# Altium project array_4x4.PrjPcb
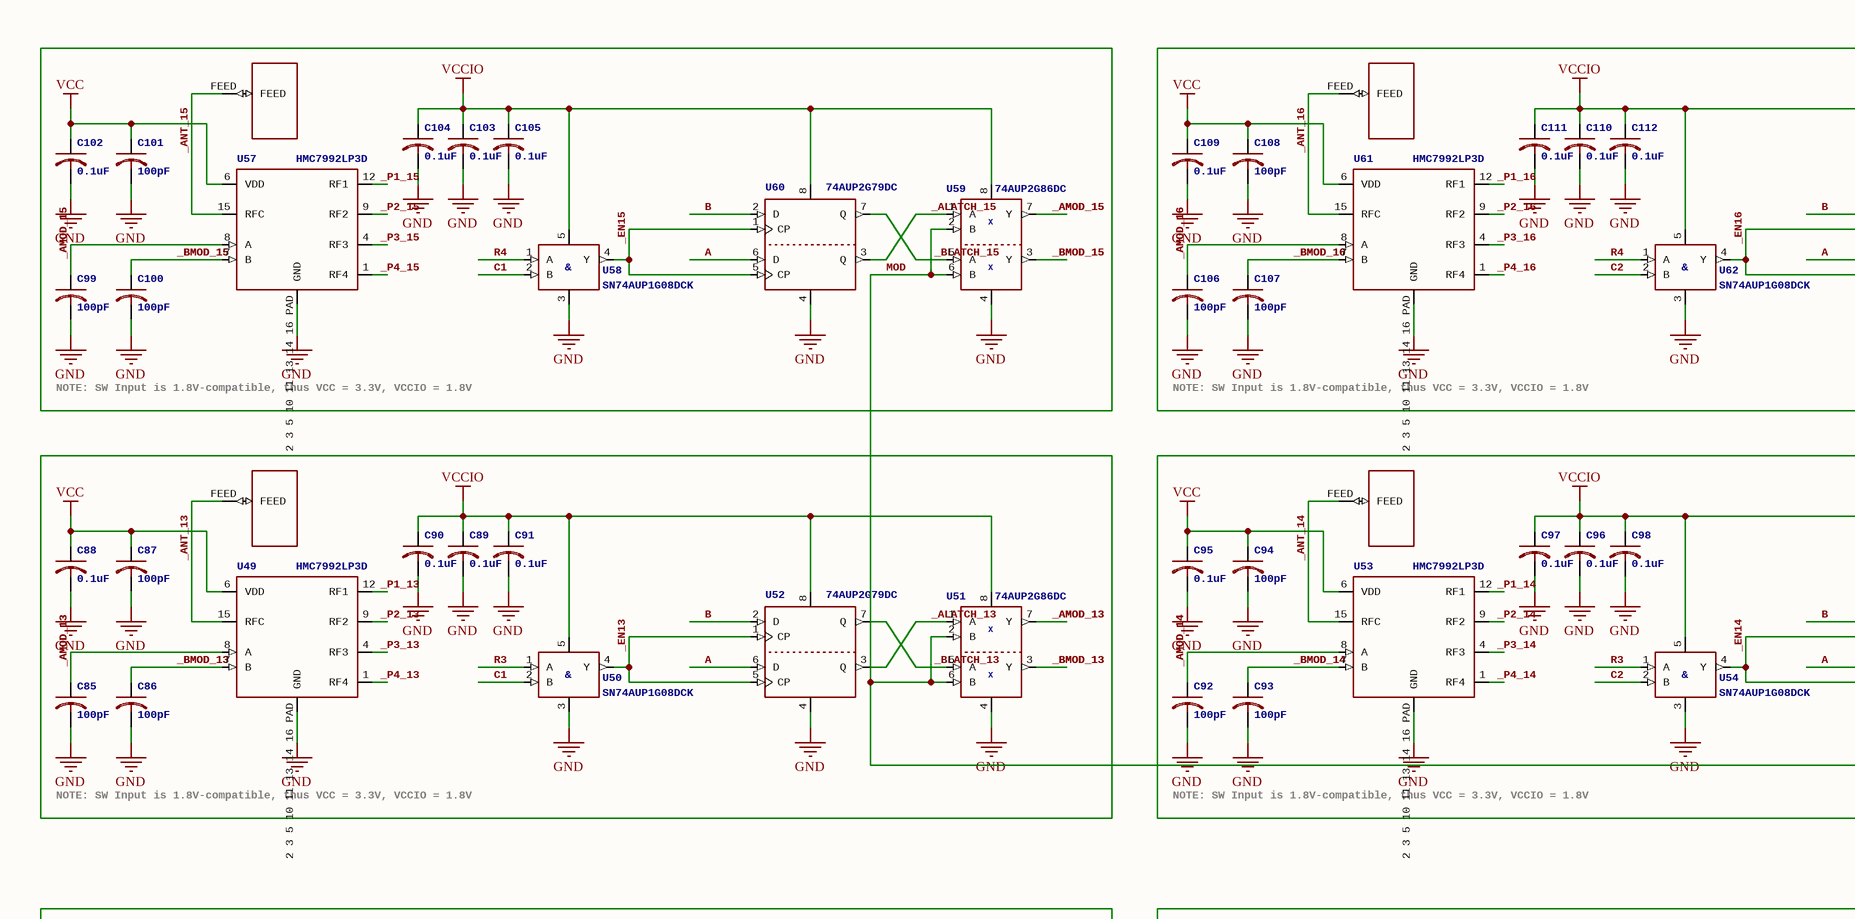
[diagram p0: array_4x4.SchDoc, top left]
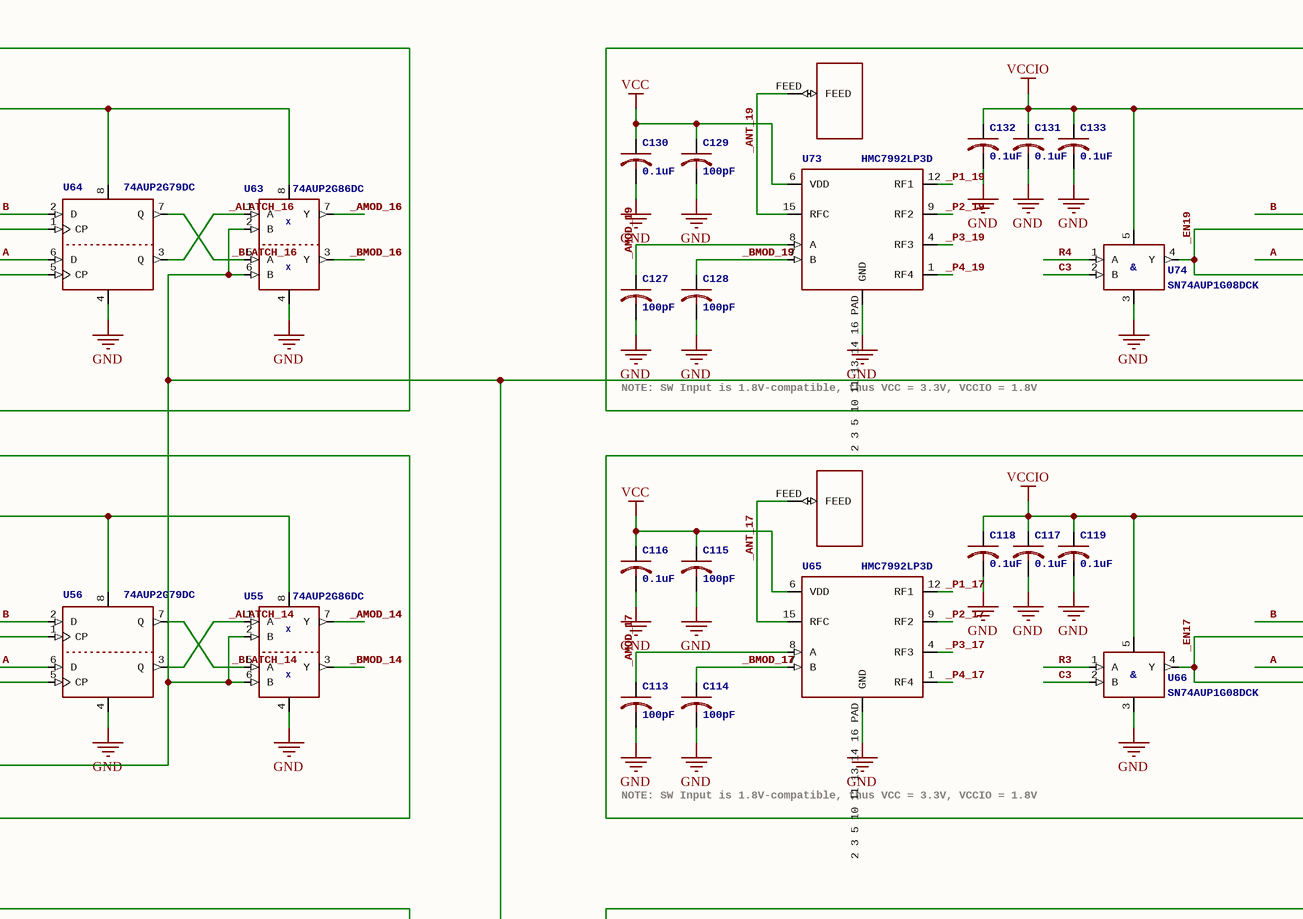
[diagram p1: array_4x4.SchDoc, top middle]
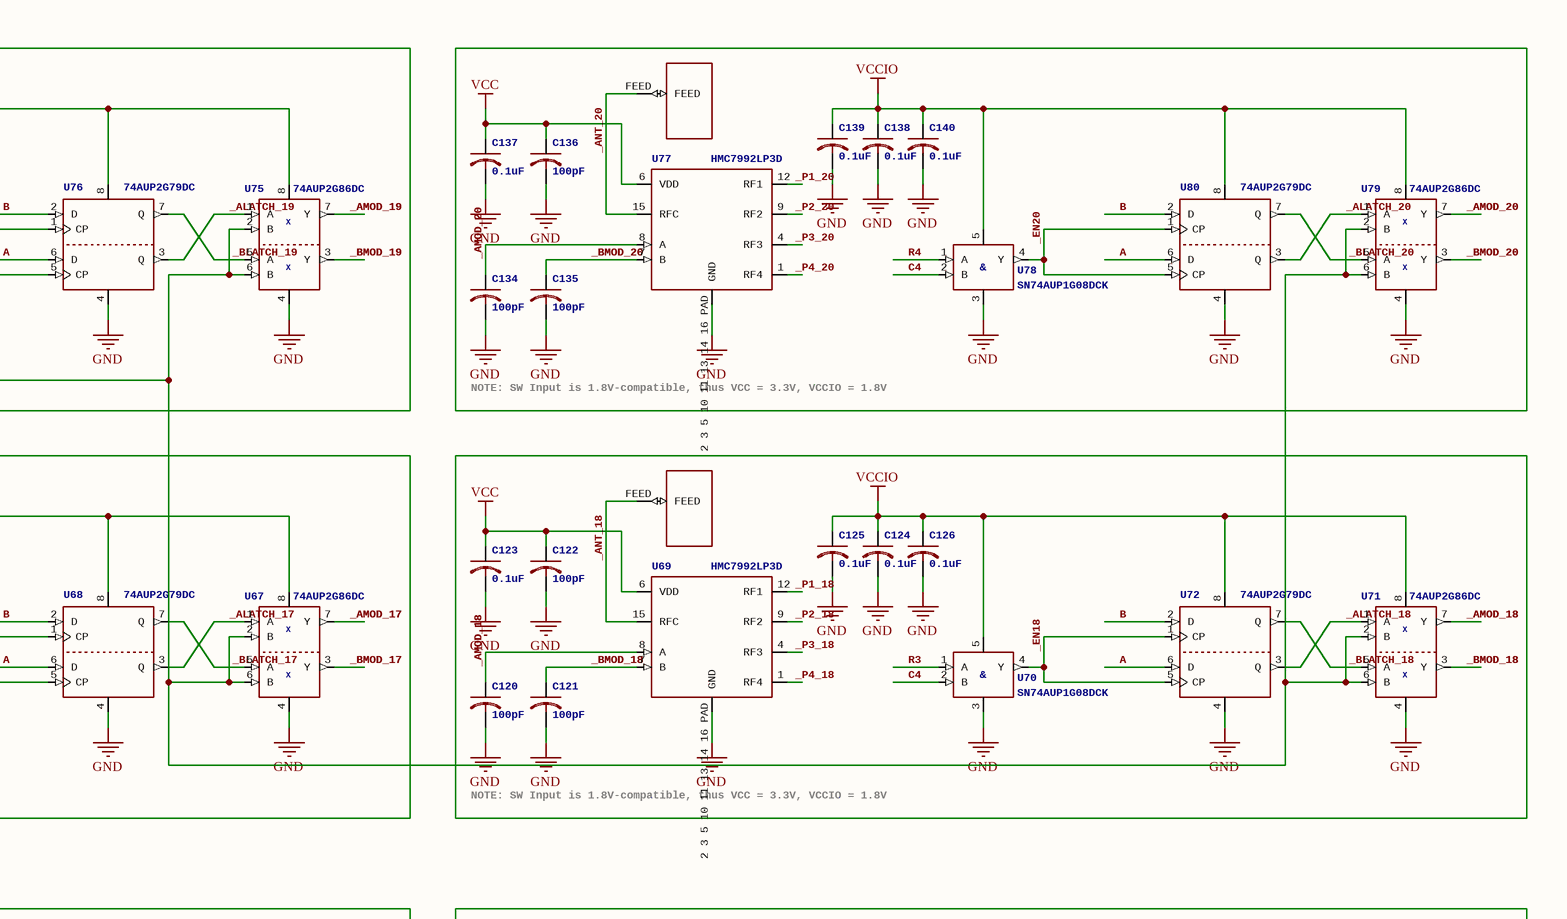
[diagram p2: array_4x4.SchDoc, top right]
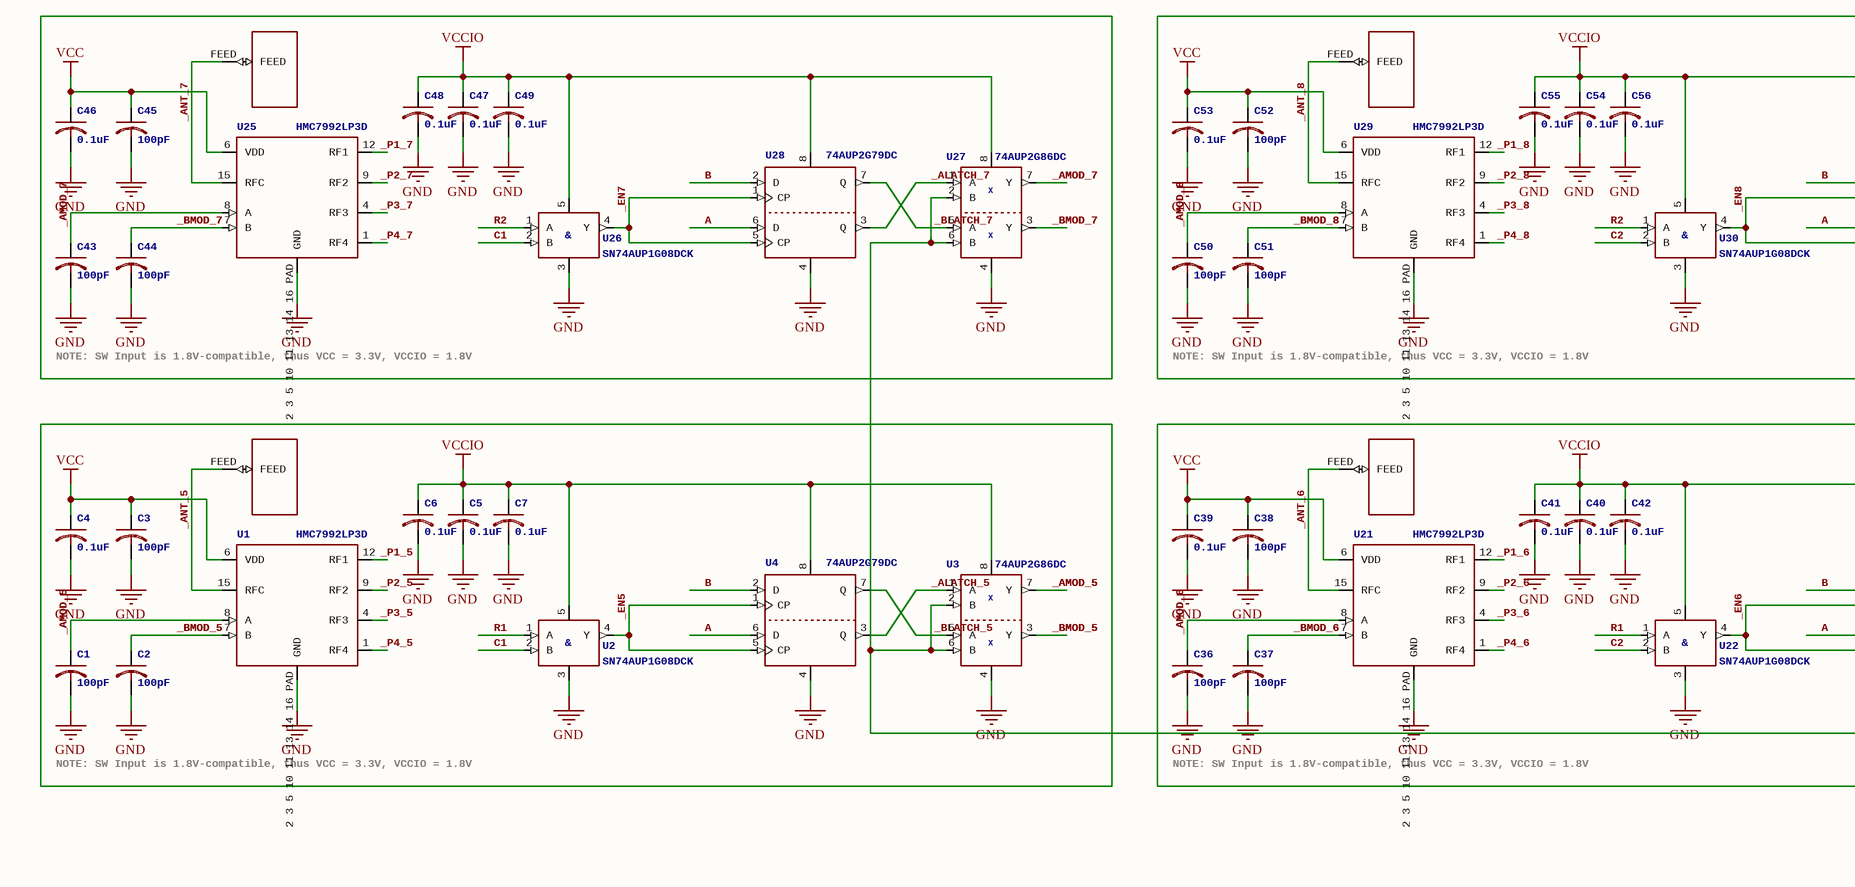
[diagram p3: array_4x4.SchDoc, bottom left]
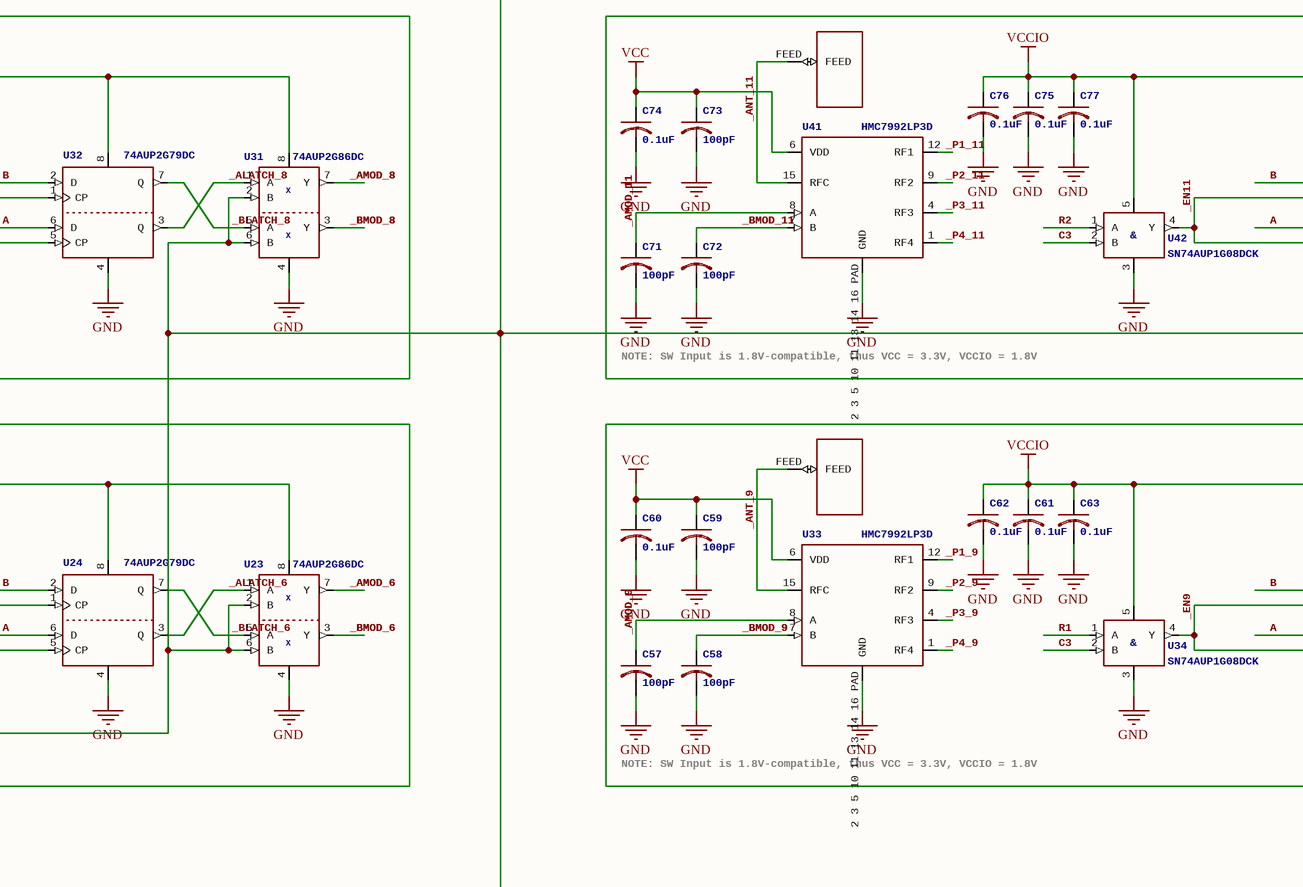
[diagram p4: array_4x4.SchDoc, bottom middle]
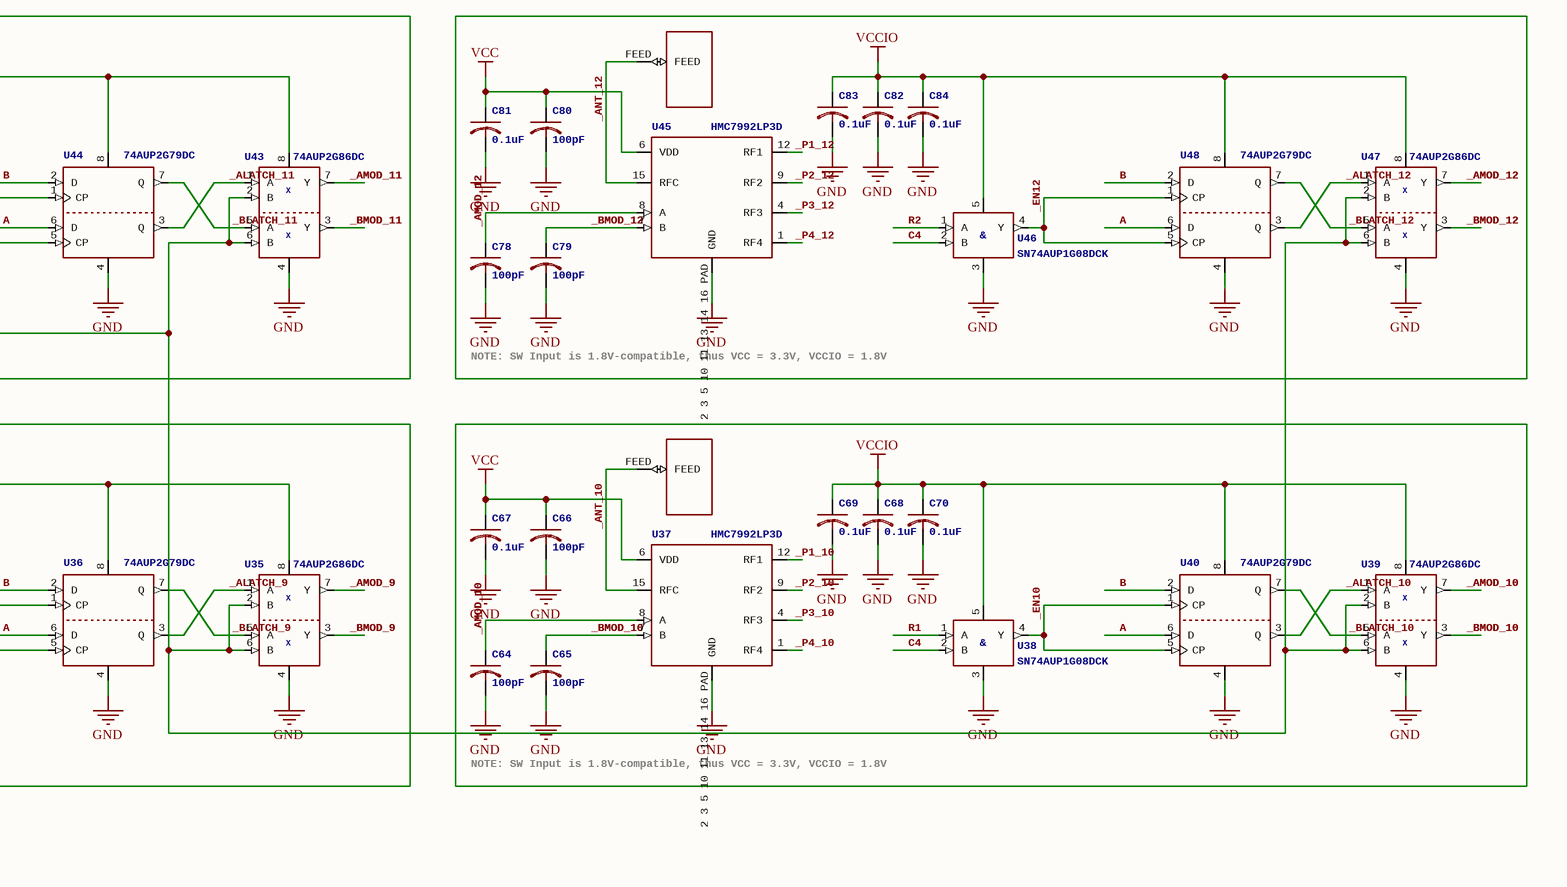
[diagram p5: array_4x4.SchDoc, bottom right]
1 sheet, 192 parts. Net scope: global (net labels, ports and power ports of the same name join across sheets).

## Sheet array_4x4.SchDoc
size 797 x 332 mm

### Parts
ANT1  5GANTENNA  [5GANTENNA]  (value not drawn)
ANT6  5GANTENNA  [5GANTENNA]  (value not drawn)
ANT7  5GANTENNA  [5GANTENNA]  (value not drawn)
ANT8  5GANTENNA  [5GANTENNA]  (value not drawn)
ANT9  5GANTENNA  [5GANTENNA]  (value not drawn)
ANT10  5GANTENNA  [5GANTENNA]  (value not drawn)
ANT11  5GANTENNA  [5GANTENNA]  (value not drawn)
ANT12  5GANTENNA  [5GANTENNA]  (value not drawn)
ANT13  5GANTENNA  [5GANTENNA]  (value not drawn)
ANT14  5GANTENNA  [5GANTENNA]  (value not drawn)
ANT15  5GANTENNA  [5GANTENNA]  (value not drawn)
ANT16  5GANTENNA  [5GANTENNA]  (value not drawn)
ANT17  5GANTENNA  [5GANTENNA]  (value not drawn)
ANT18  5GANTENNA  [5GANTENNA]  (value not drawn)
ANT19  5GANTENNA  [5GANTENNA]  (value not drawn)
ANT20  5GANTENNA  [5GANTENNA]  (value not drawn)
C1  100pF  [C0402]
C2  100pF  [C0402]
C3  100pF  [C0402]
C4  0.1uF  [C0402]
C5  0.1uF  [C0402]
C6  0.1uF  [C0402]
C7  0.1uF  [C0402]
C36  100pF  [C0402]
C37  100pF  [C0402]
C38  100pF  [C0402]
C39  0.1uF  [C0402]
C40  0.1uF  [C0402]
C41  0.1uF  [C0402]
C42  0.1uF  [C0402]
C43  100pF  [C0402]
C44  100pF  [C0402]
C45  100pF  [C0402]
C46  0.1uF  [C0402]
C47  0.1uF  [C0402]
C48  0.1uF  [C0402]
C49  0.1uF  [C0402]
C50  100pF  [C0402]
C51  100pF  [C0402]
C52  100pF  [C0402]
C53  0.1uF  [C0402]
C54  0.1uF  [C0402]
C55  0.1uF  [C0402]
C56  0.1uF  [C0402]
C57  100pF  [C0402]
C58  100pF  [C0402]
C59  100pF  [C0402]
C60  0.1uF  [C0402]
C61  0.1uF  [C0402]
C62  0.1uF  [C0402]
C63  0.1uF  [C0402]
C64  100pF  [C0402]
C65  100pF  [C0402]
C66  100pF  [C0402]
C67  0.1uF  [C0402]
C68  0.1uF  [C0402]
C69  0.1uF  [C0402]
C70  0.1uF  [C0402]
C71  100pF  [C0402]
C72  100pF  [C0402]
C73  100pF  [C0402]
C74  0.1uF  [C0402]
C75  0.1uF  [C0402]
C76  0.1uF  [C0402]
C77  0.1uF  [C0402]
C78  100pF  [C0402]
C79  100pF  [C0402]
C80  100pF  [C0402]
C81  0.1uF  [C0402]
C82  0.1uF  [C0402]
C83  0.1uF  [C0402]
C84  0.1uF  [C0402]
C85  100pF  [C0402]
C86  100pF  [C0402]
C87  100pF  [C0402]
C88  0.1uF  [C0402]
C89  0.1uF  [C0402]
C90  0.1uF  [C0402]
C91  0.1uF  [C0402]
C92  100pF  [C0402]
C93  100pF  [C0402]
C94  100pF  [C0402]
C95  0.1uF  [C0402]
C96  0.1uF  [C0402]
C97  0.1uF  [C0402]
C98  0.1uF  [C0402]
C99  100pF  [C0402]
C100  100pF  [C0402]
C101  100pF  [C0402]
C102  0.1uF  [C0402]
C103  0.1uF  [C0402]
C104  0.1uF  [C0402]
C105  0.1uF  [C0402]
C106  100pF  [C0402]
C107  100pF  [C0402]
C108  100pF  [C0402]
C109  0.1uF  [C0402]
C110  0.1uF  [C0402]
C111  0.1uF  [C0402]
C112  0.1uF  [C0402]
C113  100pF  [C0402]
C114  100pF  [C0402]
C115  100pF  [C0402]
C116  0.1uF  [C0402]
C117  0.1uF  [C0402]
C118  0.1uF  [C0402]
C119  0.1uF  [C0402]
C120  100pF  [C0402]
C121  100pF  [C0402]
C122  100pF  [C0402]
C123  0.1uF  [C0402]
C124  0.1uF  [C0402]
C125  0.1uF  [C0402]
C126  0.1uF  [C0402]
C127  100pF  [C0402]
C128  100pF  [C0402]
C129  100pF  [C0402]
C130  0.1uF  [C0402]
C131  0.1uF  [C0402]
C132  0.1uF  [C0402]
C133  0.1uF  [C0402]
C134  100pF  [C0402]
C135  100pF  [C0402]
C136  100pF  [C0402]
C137  0.1uF  [C0402]
C138  0.1uF  [C0402]
C139  0.1uF  [C0402]
C140  0.1uF  [C0402]
U1  HMC7992LP3D  [QFN-16-3X3]
U2  SN74AUP1G08DCK  [SOT-353]
U3  74AUP2G86DC  [VSSOP-8]
U4  74AUP2G79DC  [VSSOP-8]
U21  HMC7992LP3D  [QFN-16-3X3]
U22  SN74AUP1G08DCK  [SOT-353]
U23  74AUP2G86DC  [VSSOP-8]
U24  74AUP2G79DC  [VSSOP-8]
U25  HMC7992LP3D  [QFN-16-3X3]
U26  SN74AUP1G08DCK  [SOT-353]
U27  74AUP2G86DC  [VSSOP-8]
U28  74AUP2G79DC  [VSSOP-8]
U29  HMC7992LP3D  [QFN-16-3X3]
U30  SN74AUP1G08DCK  [SOT-353]
U31  74AUP2G86DC  [VSSOP-8]
U32  74AUP2G79DC  [VSSOP-8]
U33  HMC7992LP3D  [QFN-16-3X3]
U34  SN74AUP1G08DCK  [SOT-353]
U35  74AUP2G86DC  [VSSOP-8]
U36  74AUP2G79DC  [VSSOP-8]
U37  HMC7992LP3D  [QFN-16-3X3]
U38  SN74AUP1G08DCK  [SOT-353]
U39  74AUP2G86DC  [VSSOP-8]
U40  74AUP2G79DC  [VSSOP-8]
U41  HMC7992LP3D  [QFN-16-3X3]
U42  SN74AUP1G08DCK  [SOT-353]
U43  74AUP2G86DC  [VSSOP-8]
U44  74AUP2G79DC  [VSSOP-8]
U45  HMC7992LP3D  [QFN-16-3X3]
U46  SN74AUP1G08DCK  [SOT-353]
U47  74AUP2G86DC  [VSSOP-8]
U48  74AUP2G79DC  [VSSOP-8]
U49  HMC7992LP3D  [QFN-16-3X3]
U50  SN74AUP1G08DCK  [SOT-353]
U51  74AUP2G86DC  [VSSOP-8]
U52  74AUP2G79DC  [VSSOP-8]
U53  HMC7992LP3D  [QFN-16-3X3]
U54  SN74AUP1G08DCK  [SOT-353]
U55  74AUP2G86DC  [VSSOP-8]
U56  74AUP2G79DC  [VSSOP-8]
U57  HMC7992LP3D  [QFN-16-3X3]
U58  SN74AUP1G08DCK  [SOT-353]
U59  74AUP2G86DC  [VSSOP-8]
U60  74AUP2G79DC  [VSSOP-8]
U61  HMC7992LP3D  [QFN-16-3X3]
U62  SN74AUP1G08DCK  [SOT-353]
U63  74AUP2G86DC  [VSSOP-8]
U64  74AUP2G79DC  [VSSOP-8]
U65  HMC7992LP3D  [QFN-16-3X3]
U66  SN74AUP1G08DCK  [SOT-353]
U67  74AUP2G86DC  [VSSOP-8]
U68  74AUP2G79DC  [VSSOP-8]
U69  HMC7992LP3D  [QFN-16-3X3]
U70  SN74AUP1G08DCK  [SOT-353]
U71  74AUP2G86DC  [VSSOP-8]
U72  74AUP2G79DC  [VSSOP-8]
U73  HMC7992LP3D  [QFN-16-3X3]
U74  SN74AUP1G08DCK  [SOT-353]
U75  74AUP2G86DC  [VSSOP-8]
U76  74AUP2G79DC  [VSSOP-8]
U77  HMC7992LP3D  [QFN-16-3X3]
U78  SN74AUP1G08DCK  [SOT-353]
U79  74AUP2G86DC  [VSSOP-8]
U80  74AUP2G79DC  [VSSOP-8]

### Nets
GND: C1.2 C2.2 C3.2 C4.2 C5.2 C6.2 C7.2 C36.2 C37.2 C38.2 C39.2 C40.2 C41.2 C42.2 C43.2 C44.2 C45.2 C46.2 C47.2 C48.2 C49.2 C50.2 C51.2 C52.2 C53.2 C54.2 C55.2 C56.2 C57.2 C58.2 C59.2 C60.2 C61.2 C62.2 C63.2 C64.2 C65.2 C66.2 C67.2 C68.2 C69.2 C70.2 C71.2 C72.2 C73.2 C74.2 C75.2 C76.2 C77.2 C78.2 C79.2 C80.2 C81.2 C82.2 C83.2 C84.2 C85.2 C86.2 C87.2 C88.2 C89.2 C90.2 C91.2 C92.2 C93.2 C94.2 C95.2 C96.2 C97.2 C98.2 C99.2 C100.2 C101.2 C102.2 C103.2 C104.2 C105.2 C106.2 C107.2 C108.2 C109.2 C110.2 C111.2 C112.2 C113.2 C114.2 C115.2 C116.2 C117.2 C118.2 C119.2 C120.2 C121.2 C122.2 C123.2 C124.2 C125.2 C126.2 C127.2 C128.2 C129.2 C130.2 C131.2 C132.2 C133.2 C134.2 C135.2 C136.2 C137.2 C138.2 C139.2 C140.2 U1.2_3_5_10_11_13_14_16_PAD(GND) U2.3(GND) U3.4(GND) U4.4(GND) U21.2_3_5_10_11_13_14_16_PAD(GND) U22.3(GND) U23.4(GND) U24.4(GND) U25.2_3_5_10_11_13_14_16_PAD(GND) U26.3(GND) U27.4(GND) U28.4(GND) U29.2_3_5_10_11_13_14_16_PAD(GND) U30.3(GND) U31.4(GND) U32.4(GND) U33.2_3_5_10_11_13_14_16_PAD(GND) U34.3(GND) U35.4(GND) U36.4(GND) U37.2_3_5_10_11_13_14_16_PAD(GND) U38.3(GND) U39.4(GND) U40.4(GND) U41.2_3_5_10_11_13_14_16_PAD(GND) U42.3(GND) U43.4(GND) U44.4(GND) U45.2_3_5_10_11_13_14_16_PAD(GND) U46.3(GND) U47.4(GND) U48.4(GND) U49.2_3_5_10_11_13_14_16_PAD(GND) U50.3(GND) U51.4(GND) U52.4(GND) U53.2_3_5_10_11_13_14_16_PAD(GND) U54.3(GND) U55.4(GND) U56.4(GND) U57.2_3_5_10_11_13_14_16_PAD(GND) U58.3(GND) U59.4(GND) U60.4(GND) U61.2_3_5_10_11_13_14_16_PAD(GND) U62.3(GND) U63.4(GND) U64.4(GND) U65.2_3_5_10_11_13_14_16_PAD(GND) U66.3(GND) U67.4(GND) U68.4(GND) U69.2_3_5_10_11_13_14_16_PAD(GND) U70.3(GND) U71.4(GND) U72.4(GND) U73.2_3_5_10_11_13_14_16_PAD(GND) U74.3(GND) U75.4(GND) U76.4(GND) U77.2_3_5_10_11_13_14_16_PAD(GND) U78.3(GND) U79.4(GND) U80.4(GND)
VCC: C3.1 C4.1 C38.1 C39.1 C45.1 C46.1 C52.1 C53.1 C59.1 C60.1 C66.1 C67.1 C73.1 C74.1 C80.1 C81.1 C87.1 C88.1 C94.1 C95.1 C101.1 C102.1 C108.1 C109.1 C115.1 C116.1 C122.1 C123.1 C129.1 C130.1 C136.1 C137.1 U1.6(VDD) U21.6(VDD) U25.6(VDD) U29.6(VDD) U33.6(VDD) U37.6(VDD) U41.6(VDD) U45.6(VDD) U49.6(VDD) U53.6(VDD) U57.6(VDD) U61.6(VDD) U65.6(VDD) U69.6(VDD) U73.6(VDD) U77.6(VDD)
VCCIO: C5.1 C6.1 C7.1 C40.1 C41.1 C42.1 C47.1 C48.1 C49.1 C54.1 C55.1 C56.1 C61.1 C62.1 C63.1 C68.1 C69.1 C70.1 C75.1 C76.1 C77.1 C82.1 C83.1 C84.1 C89.1 C90.1 C91.1 C96.1 C97.1 C98.1 C103.1 C104.1 C105.1 C110.1 C111.1 C112.1 C117.1 C118.1 C119.1 C124.1 C125.1 C126.1 C131.1 C132.1 C133.1 C138.1 C139.1 C140.1 U2.5(VCC) U3.8(VCC) U4.8(VCC) U22.5(VCC) U23.8(VCC) U24.8(VCC) U26.5(VCC) U27.8(VCC) U28.8(VCC) U30.5(VCC) U31.8(VCC) U32.8(VCC) U34.5(VCC) U35.8(VCC) U36.8(VCC) U38.5(VCC) U39.8(VCC) U40.8(VCC) U42.5(VCC) U43.8(VCC) U44.8(VCC) U46.5(VCC) U47.8(VCC) U48.8(VCC) U50.5(VCC) U51.8(VCC) U52.8(VCC) U54.5(VCC) U55.8(VCC) U56.8(VCC) U58.5(VCC) U59.8(VCC) U60.8(VCC) U62.5(VCC) U63.8(VCC) U64.8(VCC) U66.5(VCC) U67.8(VCC) U68.8(VCC) U70.5(VCC) U71.8(VCC) U72.8(VCC) U74.5(VCC) U75.8(VCC) U76.8(VCC) U78.5(VCC) U79.8(VCC) U80.8(VCC)
_ALATCH_7: U27.1(A) U28.3(Q)
_ALATCH_8: U31.1(A) U32.3(Q)
_ALATCH_10: U3.1(A) U3.2(B) U3.5(A) U3.6(B) U4.3(Q) U4.7(Q) U23.1(A) U23.2(B) U23.5(A) U23.6(B) U24.3(Q) U24.7(Q) U27.2(B) U27.6(B) U31.2(B) U31.6(B) U35.1(A) U35.2(B) U35.5(A) U35.6(B) U36.3(Q) U36.7(Q) U39.1(A) U39.2(B) U39.5(A) U39.6(B) U40.3(Q) U40.7(Q) U43.2(B) U43.6(B) U47.2(B) U47.6(B) U51.1(A) U51.2(B) U51.5(A) U51.6(B) U52.3(Q) U52.7(Q) U55.1(A) U55.2(B) U55.5(A) U55.6(B) U56.3(Q) U56.7(Q) U59.2(B) U59.6(B) U63.2(B) U63.6(B) U67.1(A) U67.2(B) U67.5(A) U67.6(B) U68.3(Q) U68.7(Q) U71.1(A) U71.2(B) U71.5(A) U71.6(B) U72.3(Q) U72.7(Q) U75.2(B) U75.6(B) U79.2(B) U79.6(B)  [also labelled _ALATCH_13, _ALATCH_14, _ALATCH_17, _ALATCH_18, _ALATCH_5, _ALATCH_6, _ALATCH_9, _BLATCH_10, _BLATCH_13, _BLATCH_14, _BLATCH_17, _BLATCH_18, _BLATCH_5, _BLATCH_6, _BLATCH_9, MOD]
_ALATCH_11: U43.1(A) U44.3(Q)
_ALATCH_12: U47.1(A) U48.3(Q)
_ALATCH_15: U59.1(A) U60.3(Q)
_ALATCH_16: U63.1(A) U64.3(Q)
_ALATCH_19: U75.1(A) U76.3(Q)
_ALATCH_20: U79.1(A) U80.3(Q)
_AMOD_5: C1.1 U1.8(A) U3.7(Y)
_AMOD_6: C36.1 U21.8(A) U23.7(Y)
_AMOD_7: C43.1 U25.8(A) U27.7(Y)
_AMOD_8: C50.1 U29.8(A) U31.7(Y)
_AMOD_9: C57.1 U33.8(A) U35.7(Y)
_AMOD_10: C64.1 U37.8(A) U39.7(Y)
_AMOD_11: C71.1 U41.8(A) U43.7(Y)
_AMOD_12: C78.1 U45.8(A) U47.7(Y)
_AMOD_13: C85.1 U49.8(A) U51.7(Y)
_AMOD_14: C92.1 U53.8(A) U55.7(Y)
_AMOD_15: C99.1 U57.8(A) U59.7(Y)
_AMOD_16: C106.1 U61.8(A) U63.7(Y)
_AMOD_17: C113.1 U65.8(A) U67.7(Y)
_AMOD_18: C120.1 U69.8(A) U71.7(Y)
_AMOD_19: C127.1 U73.8(A) U75.7(Y)
_AMOD_20: C134.1 U77.8(A) U79.7(Y)
_ANT_5: ANT1.FEED U1.15(RFC)
_ANT_6: ANT6.FEED U21.15(RFC)
_ANT_7: ANT7.FEED U25.15(RFC)
_ANT_8: ANT8.FEED U29.15(RFC)
_ANT_9: ANT9.FEED U33.15(RFC)
_ANT_10: ANT10.FEED U37.15(RFC)
_ANT_11: ANT11.FEED U41.15(RFC)
_ANT_12: ANT12.FEED U45.15(RFC)
_ANT_13: ANT13.FEED U49.15(RFC)
_ANT_14: ANT14.FEED U53.15(RFC)
_ANT_15: ANT15.FEED U57.15(RFC)
_ANT_16: ANT16.FEED U61.15(RFC)
_ANT_17: ANT17.FEED U65.15(RFC)
_ANT_18: ANT18.FEED U69.15(RFC)
_ANT_19: ANT19.FEED U73.15(RFC)
_ANT_20: ANT20.FEED U77.15(RFC)
_BLATCH_7: U27.5(A) U28.7(Q)
_BLATCH_8: U31.5(A) U32.7(Q)
_BLATCH_11: U43.5(A) U44.7(Q)
_BLATCH_12: U47.5(A) U48.7(Q)
_BLATCH_15: U59.5(A) U60.7(Q)
_BLATCH_16: U63.5(A) U64.7(Q)
_BLATCH_19: U75.5(A) U76.7(Q)
_BLATCH_20: U79.5(A) U80.7(Q)
_BMOD_5: C2.1 U1.7(B) U3.3(Y)
_BMOD_6: C37.1 U21.7(B) U23.3(Y)
_BMOD_7: C44.1 U25.7(B) U27.3(Y)
_BMOD_8: C51.1 U29.7(B) U31.3(Y)
_BMOD_9: C58.1 U33.7(B) U35.3(Y)
_BMOD_10: C65.1 U37.7(B) U39.3(Y)
_BMOD_11: C72.1 U41.7(B) U43.3(Y)
_BMOD_12: C79.1 U45.7(B) U47.3(Y)
_BMOD_13: C86.1 U49.7(B) U51.3(Y)
_BMOD_14: C93.1 U53.7(B) U55.3(Y)
_BMOD_15: C100.1 U57.7(B) U59.3(Y)
_BMOD_16: C107.1 U61.7(B) U63.3(Y)
_BMOD_17: C114.1 U65.7(B) U67.3(Y)
_BMOD_18: C121.1 U69.7(B) U71.3(Y)
_BMOD_19: C128.1 U73.7(B) U75.3(Y)
_BMOD_20: C135.1 U77.7(B) U79.3(Y)
_EN5: U2.4(Y) U4.1(CP) U4.5(CP)
_EN6: U22.4(Y) U24.1(CP) U24.5(CP)
_EN7: U26.4(Y) U28.1(CP) U28.5(CP)
_EN8: U30.4(Y) U32.1(CP) U32.5(CP)
_EN9: U34.4(Y) U36.1(CP) U36.5(CP)
_EN10: U38.4(Y) U40.1(CP) U40.5(CP)
_EN11: U42.4(Y) U44.1(CP) U44.5(CP)
_EN12: U46.4(Y) U48.1(CP) U48.5(CP)
_EN13: U50.4(Y) U52.1(CP) U52.5(CP)
_EN14: U54.4(Y) U56.1(CP) U56.5(CP)
_EN15: U58.4(Y) U60.1(CP) U60.5(CP)
_EN16: U62.4(Y) U64.1(CP) U64.5(CP)
_EN17: U66.4(Y) U68.1(CP) U68.5(CP)
_EN18: U70.4(Y) U72.1(CP) U72.5(CP)
_EN19: U74.4(Y) U76.1(CP) U76.5(CP)
_EN20: U78.4(Y) U80.1(CP) U80.5(CP)
_P1_5: U1.12(RF1)
_P1_6: U21.12(RF1)
_P1_7: U25.12(RF1)
_P1_8: U29.12(RF1)
_P1_9: U33.12(RF1)
_P1_10: U37.12(RF1)
_P1_11: U41.12(RF1)
_P1_12: U45.12(RF1)
_P1_13: U49.12(RF1)
_P1_14: U53.12(RF1)
_P1_15: U57.12(RF1)
_P1_16: U61.12(RF1)
_P1_17: U65.12(RF1)
_P1_18: U69.12(RF1)
_P1_19: U73.12(RF1)
_P1_20: U77.12(RF1)
_P2_5: U1.9(RF2)
_P2_6: U21.9(RF2)
_P2_7: U25.9(RF2)
_P2_8: U29.9(RF2)
_P2_9: U33.9(RF2)
_P2_10: U37.9(RF2)
_P2_11: U41.9(RF2)
_P2_12: U45.9(RF2)
_P2_13: U49.9(RF2)
_P2_14: U53.9(RF2)
_P2_15: U57.9(RF2)
_P2_16: U61.9(RF2)
_P2_17: U65.9(RF2)
_P2_18: U69.9(RF2)
_P2_19: U73.9(RF2)
_P2_20: U77.9(RF2)
_P3_5: U1.4(RF3)
_P3_6: U21.4(RF3)
_P3_7: U25.4(RF3)
_P3_8: U29.4(RF3)
_P3_9: U33.4(RF3)
_P3_10: U37.4(RF3)
_P3_11: U41.4(RF3)
_P3_12: U45.4(RF3)
_P3_13: U49.4(RF3)
_P3_14: U53.4(RF3)
_P3_15: U57.4(RF3)
_P3_16: U61.4(RF3)
_P3_17: U65.4(RF3)
_P3_18: U69.4(RF3)
_P3_19: U73.4(RF3)
_P3_20: U77.4(RF3)
_P4_5: U1.1(RF4)
_P4_6: U21.1(RF4)
_P4_7: U25.1(RF4)
_P4_8: U29.1(RF4)
_P4_9: U33.1(RF4)
_P4_10: U37.1(RF4)
_P4_11: U41.1(RF4)
_P4_12: U45.1(RF4)
_P4_13: U49.1(RF4)
_P4_14: U53.1(RF4)
_P4_15: U57.1(RF4)
_P4_16: U61.1(RF4)
_P4_17: U65.1(RF4)
_P4_18: U69.1(RF4)
_P4_19: U73.1(RF4)
_P4_20: U77.1(RF4)
A: U4.6(D) U24.6(D) U28.6(D) U32.6(D) U36.6(D) U40.6(D) U44.6(D) U48.6(D) U52.6(D) U56.6(D) U60.6(D) U64.6(D) U68.6(D) U72.6(D) U76.6(D) U80.6(D)
B: U4.2(D) U24.2(D) U28.2(D) U32.2(D) U36.2(D) U40.2(D) U44.2(D) U48.2(D) U52.2(D) U56.2(D) U60.2(D) U64.2(D) U68.2(D) U72.2(D) U76.2(D) U80.2(D)
C1: U2.2(B) U26.2(B) U50.2(B) U58.2(B)
C2: U22.2(B) U30.2(B) U54.2(B) U62.2(B)
C3: U34.2(B) U42.2(B) U66.2(B) U74.2(B)
C4: U38.2(B) U46.2(B) U70.2(B) U78.2(B)
R1: U2.1(A) U22.1(A) U34.1(A) U38.1(A)
R2: U26.1(A) U30.1(A) U42.1(A) U46.1(A)
R3: U50.1(A) U54.1(A) U66.1(A) U70.1(A)
R4: U58.1(A) U62.1(A) U74.1(A) U78.1(A)

### Notes on the sheet
- NOTE: SW Input is 1.8V-compatible, thus VCC = 3.3V, VCCIO = 1.8V

### Library data of the parts
ANT1 ANT6-ANT20 = 5GANTENNA: GateName_1: G$1; SymbolName_1: 5GANTENNA; LibraryName: dword1511-Antenna; DeviceSetName: 5GANTENNA
C1-C7 C36-C140 = C-USC0402: CAPACITOR, American symbol; GateName_1: G$1; SymbolName_1: C-US; DeviceName: C0402; LibraryName: rcl; DeviceSetName: C-US; SPICEPREFIX: C
U1 U21 U25 U29 U33 U37 U41 U45 U49 U53 U57 U61 U65 U69 U73 U77 = HMC7992LP3D: GateName_1: G$1; DeviceName: LP3D; SymbolName_1: HMC7992; LibraryName: dword1511-rfic; DeviceSetName: HMC7992
U2 U22 U26 U30 U34 U38 U42 U46 U50 U54 U58 U62 U66 U70 U74 U78 = SN74AUP1G08DCK: Low-Power Single 2-Input Positive AND Gate; GateName_1: G$1; SymbolName_1: 7408-1G; DeviceName: DCK; LibraryName: dword1511-logic; DeviceSetName: SN74AUP1G08; &: &
U3 U23 U27 U31 U35 U39 U43 U47 U51 U55 U59 U63 U67 U71 U75 U79 = 74AUP2G86DC: Low-power dual 2-input XOR gate; GateName_1: G$1; SymbolName_1: 7486-2G; DeviceName: DC; LibraryName: dword1511-logic; DeviceSetName: 74AUP2G86; X: X
U4 U24 U28 U32 U36 U40 U44 U48 U52 U56 U60 U64 U68 U72 U76 U80 = 74AUP2G79DC: Low-power dual D-type flip-flop with positive-edge trigger; GateName_1: G$1; SymbolName_1: 7479-2G; DeviceName: DC; LibraryName: dword1511-logic; DeviceSetName: 74AUP2G79